# Altium schematic sheet Sinalização_Comunicação.SchDoc
size A4; SheetNumber: 2; SheetTotal: 4
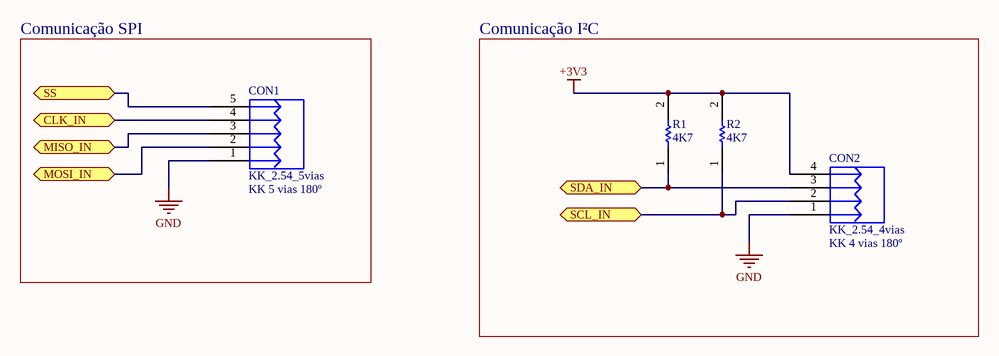
[diagram p0: Sinalização_Comunicação.SchDoc]

## Parts
CON1  KK_2.54_5vias  Valor: KK 5 vias 180º  [KK_5vias_180°]
CON2  KK_2.54_4vias  Valor: KK 4 vias 180º  [KK_4vias_180°]
R1  4K7  [RESC3216X60N]
R2  4K7  [RESC3216X60N]

## Blocks framed on the sheet
Comunicação SPI: CON1
Comunicação I²C: CON2 R1 R2

## Ports
CLK_IN (bidir), MISO_IN (bidir), MOSI_IN (bidir), SCL_IN (bidir), SDA_IN (bidir), SS (bidir)

## Nets
+3V3: CON2.4 R1.2 R2.2
GND: CON1.1 CON2.1
CLK_IN: CON1.4 ; port CLK_IN
MISO_IN: CON1.3 ; port MISO_IN
MOSI_IN: CON1.2 ; port MOSI_IN
SCL_IN: CON2.2 R2.1 ; port SCL_IN
SDA_IN: CON2.3 R1.1 ; port SDA_IN
SS: CON1.5 ; port SS

## Library data of the parts
CON1 = KK_2.54_5vias: Conector KK 2.54mm 5 vias; Descrição: Conector KK 3 vias com passo 2.54mm; Encapsulamento: PTH - 180º; Modelo: 3 vias - 180º; Marca: *; Observação: *
CON2 = KK_2.54_4vias: Conector KK 2.54mm 4 vias; Descrição: Conector KK 3 vias com passo 2.54mm; Encapsulamento: PTH - 180º; Modelo: 3 vias - 180º; Marca: *; Observação: *
R1 R2 = Resistor 1206: Resistor; Manufacturer_Name: Vishay; Manufacturer_Part_Number: CRCW12064K70FKEA; Datasheet Link: http://docs-emea.rs-online.com/webdocs/13ec/0900766b813ecc08.pdf; Height: 0.6mm; Mouser Part Number: 71-CRCW1206-4.7K-E3; Mouser Price/Stock: https://www.mouser.co.uk/ProductDetail/Vishay-Dale/CRCW12064K70FKEA?qs=1vm4qhDHCvlKJmatsKzyFQ%3D%3D; Arrow Part Number: CRCW12064K70FKEA; Arrow Price/Stock: https://www.arrow.com/en/products/crcw12064k70fkea/vishay